# Altium schematic sheet [2]-BLOCK_DIAGRAM.SchDoc
size A4
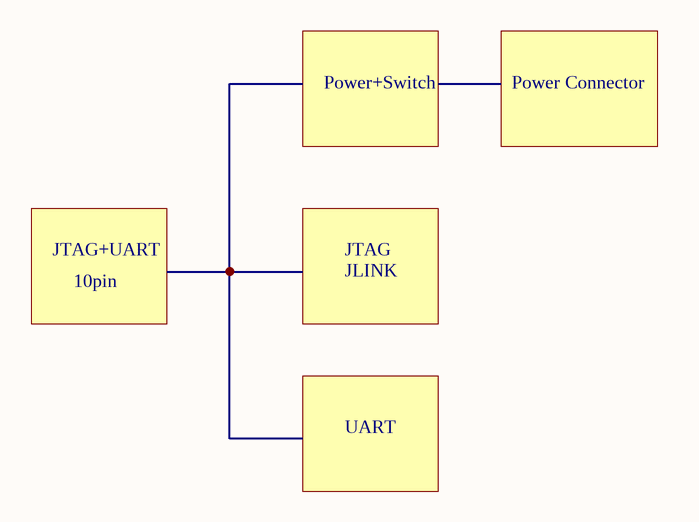
[diagram p0: [2]-BLOCK_DIAGRAM.SchDoc]

## Notes on the sheet
- Power+Switch
- Power Connector
- JTAG+UART
- JTAG
- 10pin
- JLINK
- UART